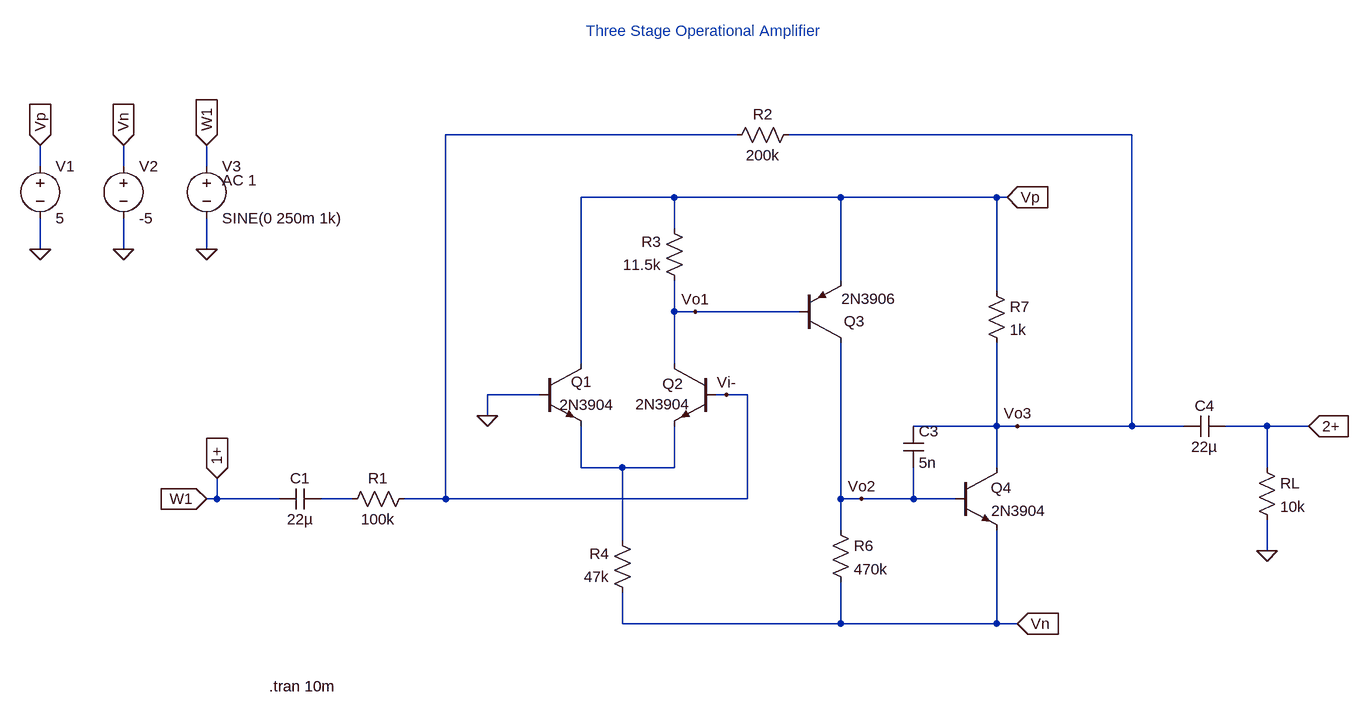
[diagram p0: schematic opamp.asc]
opamp.asc, the LTspice schematic file:
Version 4
SHEET 1 1420 680
WIRE 464 -320 16 -320
WIRE 1072 -320 544 -320
WIRE -608 -272 -608 -304
WIRE -480 -272 -480 -304
WIRE -352 -272 -352 -304
WIRE 368 -224 224 -224
WIRE 624 -224 368 -224
WIRE 864 -224 624 -224
WIRE 880 -224 864 -224
WIRE 368 -176 368 -224
WIRE -608 -144 -608 -192
WIRE -480 -144 -480 -192
WIRE -352 -144 -352 -192
WIRE 624 -96 624 -224
WIRE 864 -80 864 -224
WIRE 368 -48 368 -96
WIRE 400 -48 368 -48
WIRE 560 -48 400 -48
WIRE 224 32 224 -224
WIRE 368 32 368 -48
WIRE 160 80 80 80
WIRE 448 80 432 80
WIRE 480 80 448 80
WIRE 80 112 80 80
WIRE 864 128 864 0
WIRE 864 128 736 128
WIRE 896 128 864 128
WIRE 1072 128 1072 -320
WIRE 1072 128 896 128
WIRE 1152 128 1072 128
WIRE 1280 128 1216 128
WIRE 1344 128 1280 128
WIRE 224 192 224 128
WIRE 288 192 224 192
WIRE 368 192 368 128
WIRE 368 192 288 192
WIRE 864 192 864 128
WIRE 1280 192 1280 128
WIRE -336 240 -336 208
WIRE -336 240 -352 240
WIRE -240 240 -336 240
WIRE -128 240 -176 240
WIRE 16 240 16 -320
WIRE 16 240 -48 240
WIRE 480 240 480 80
WIRE 480 240 16 240
WIRE 624 240 624 0
WIRE 656 240 624 240
WIRE 736 240 736 192
WIRE 736 240 656 240
WIRE 800 240 736 240
WIRE 624 288 624 240
WIRE 288 304 288 192
WIRE 1280 320 1280 272
WIRE 288 432 288 384
WIRE 624 432 624 368
WIRE 624 432 288 432
WIRE 864 432 864 288
WIRE 864 432 624 432
WIRE 896 432 864 432
FLAG 80 112 0
FLAG 1280 320 0
FLAG -352 240 W1
IOPIN -352 240 In
FLAG 880 -224 Vp
IOPIN 880 -224 In
FLAG 1344 128 2+
IOPIN 1344 128 In
FLAG 896 432 Vn
IOPIN 896 432 In
FLAG -336 208 1+
IOPIN -336 208 In
FLAG -608 -144 0
FLAG -480 -144 0
FLAG -352 -144 0
FLAG -352 -304 W1
IOPIN -352 -304 In
FLAG -480 -304 Vn
IOPIN -480 -304 In
FLAG -608 -304 Vp
IOPIN -608 -304 In
FLAG 448 80 Vi-
FLAG 400 -48 Vo1
FLAG 656 240 Vo2
FLAG 896 128 Vo3
SYMBOL npn 160 32 R0
WINDOW 0 49 28 Left 2
WINDOW 3 31 63 Left 2
SYMATTR InstName Q1
SYMATTR Value 2N3904
SYMBOL npn 432 32 M0
WINDOW 3 39 62 Left 2
WINDOW 0 50 31 Left 2
SYMATTR Value 2N3904
SYMATTR InstName Q2
SYMBOL pnp 560 0 M180
WINDOW 0 69 33 Left 2
WINDOW 3 65 68 Left 2
SYMATTR InstName Q3
SYMATTR Value 2N3906
SYMBOL npn 800 192 R0
WINDOW 0 55 31 Left 2
WINDOW 3 56 66 Left 2
SYMATTR InstName Q4
SYMATTR Value 2N3904
SYMBOL res -32 224 R90
WINDOW 0 0 56 VBottom 2
WINDOW 3 32 56 VTop 2
SYMATTR InstName R1
SYMATTR Value 100k
SYMBOL res 560 -336 R90
WINDOW 0 0 56 VBottom 2
WINDOW 3 32 56 VTop 2
SYMATTR InstName R2
SYMATTR Value 200k
SYMBOL res 384 -80 R180
WINDOW 0 36 76 Left 2
WINDOW 3 36 40 Left 2
SYMATTR InstName R3
SYMATTR Value 11.5k
SYMBOL res 304 400 R180
WINDOW 0 36 76 Left 2
WINDOW 3 36 40 Left 2
SYMATTR InstName R4
SYMATTR Value 47k
SYMBOL res 608 272 R0
SYMATTR InstName R6
SYMATTR Value 470k
SYMBOL res 848 -96 R0
SYMATTR InstName R7
SYMATTR Value 1k
SYMBOL res 1264 176 R0
SYMATTR InstName RL
SYMATTR Value 10k
SYMBOL cap -176 224 R90
WINDOW 0 0 32 VBottom 2
WINDOW 3 32 32 VTop 2
SYMATTR InstName C1
SYMATTR Value 22µ
SYMBOL cap 1152 144 R270
WINDOW 0 32 32 VTop 2
WINDOW 3 0 32 VBottom 2
SYMATTR InstName C4
SYMATTR Value 22µ
SYMBOL voltage -608 -288 R0
WINDOW 123 0 0 Left 0
WINDOW 39 0 0 Left 0
SYMATTR InstName V1
SYMATTR Value 5
SYMBOL voltage -480 -288 R0
WINDOW 123 0 0 Left 0
WINDOW 39 0 0 Left 0
SYMATTR InstName V2
SYMATTR Value -5
SYMBOL voltage -352 -288 R0
WINDOW 123 24 38 Left 2
WINDOW 39 0 0 Left 0
SYMATTR Value2 AC 1
SYMATTR InstName V3
SYMATTR Value SINE(0 250m 1k)
SYMBOL cap 720 128 R0
SYMATTR InstName C3
SYMATTR Value 5n
TEXT -256 528 Left 2 !.tran 10m
TEXT 232 -480 Left 2 ;Three Stage Operational Amplifier

The netlist it stands for:
* opamp.asc
Q1 Vp 0 N001 0 2N3904
Q2 Vo1 Vi- N001 0 2N3904
Q3 Vo2 Vo1 Vp 0 2N3906
Q4 Vo3 Vo2 Vn 0 2N3904
R1 Vi- N002 100k
R2 Vo3 Vi- 200k
R3 Vo1 Vp 11.5k
R4 Vn N001 47k
R6 Vo2 Vn 470k
R7 Vp Vo3 1k
RL 2+ 0 10k
C1 N002 1+ 22µ
C4 Vo3 2+ 22µ
V1 Vp 0 5
V2 Vn 0 -5
V3 1+ 0 SINE(0 250m 1k) AC 1
C3 Vo3 Vo2 5n
.model NPN NPN
.model PNP PNP
.lib standard.bjt
.tran 10m
* Three Stage Operational Amplifier
.backanno
.end